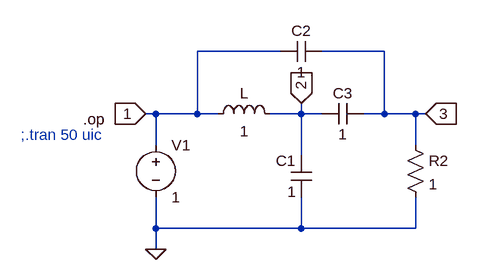
[diagram p0: schematic Bridge-T.asc]
Bridge-T.asc, the LTspice schematic file:
Version 4
SHEET 1 880 680
WIRE 240 16 112 16
WIRE 400 16 304 16
WIRE 48 112 32 112
WIRE 112 112 112 16
WIRE 112 112 48 112
WIRE 144 112 112 112
WIRE 272 112 272 96
WIRE 272 112 224 112
WIRE 304 112 272 112
WIRE 400 112 400 16
WIRE 400 112 368 112
WIRE 448 112 400 112
WIRE 464 112 448 112
WIRE 48 160 48 112
WIRE 448 160 448 112
WIRE 272 176 272 112
WIRE 48 288 48 240
WIRE 272 288 272 240
WIRE 272 288 48 288
WIRE 448 288 448 240
WIRE 448 288 272 288
WIRE 48 320 48 288
FLAG 48 320 0
FLAG 32 112 1
IOPIN 32 112 In
FLAG 272 96 2
IOPIN 272 96 In
FLAG 464 112 3
IOPIN 464 112 In
SYMBOL voltage 48 144 R0
WINDOW 123 0 0 Left 0
WINDOW 39 0 0 Left 0
SYMATTR InstName V1
SYMATTR Value 1
SYMBOL cap 304 0 R90
WINDOW 0 0 32 VBottom 2
WINDOW 3 32 32 VTop 2
SYMATTR InstName C2
SYMATTR Value 1
SYMBOL cap 368 96 R90
WINDOW 0 0 32 VBottom 2
WINDOW 3 32 32 VTop 2
SYMATTR InstName C3
SYMATTR Value 1
SYMBOL cap 288 240 R180
WINDOW 0 24 56 Left 2
WINDOW 3 24 8 Left 2
SYMATTR InstName C1
SYMATTR Value 1
SYMBOL ind 128 128 R270
WINDOW 0 32 56 VTop 2
WINDOW 3 5 56 VBottom 2
SYMATTR InstName L
SYMATTR Value 1
SYMATTR SpiceLine Rser=0
SYMBOL res 432 144 R0
SYMATTR InstName R2
SYMATTR Value 1
TEXT -64 120 Left 2 !.op
TEXT -160 144 Left 2 ;;.tran 50 uic

The netlist it stands for:
* Bridge-T.asc
V1 1 0 1
C2 3 1 1
C3 3 2 1
C1 0 2 1
L 1 2 1 Rser=0
R2 3 0 1
.op
* ;.tran 50 uic
.backanno
.end